# Altium project PCB_Project.PrjPcb
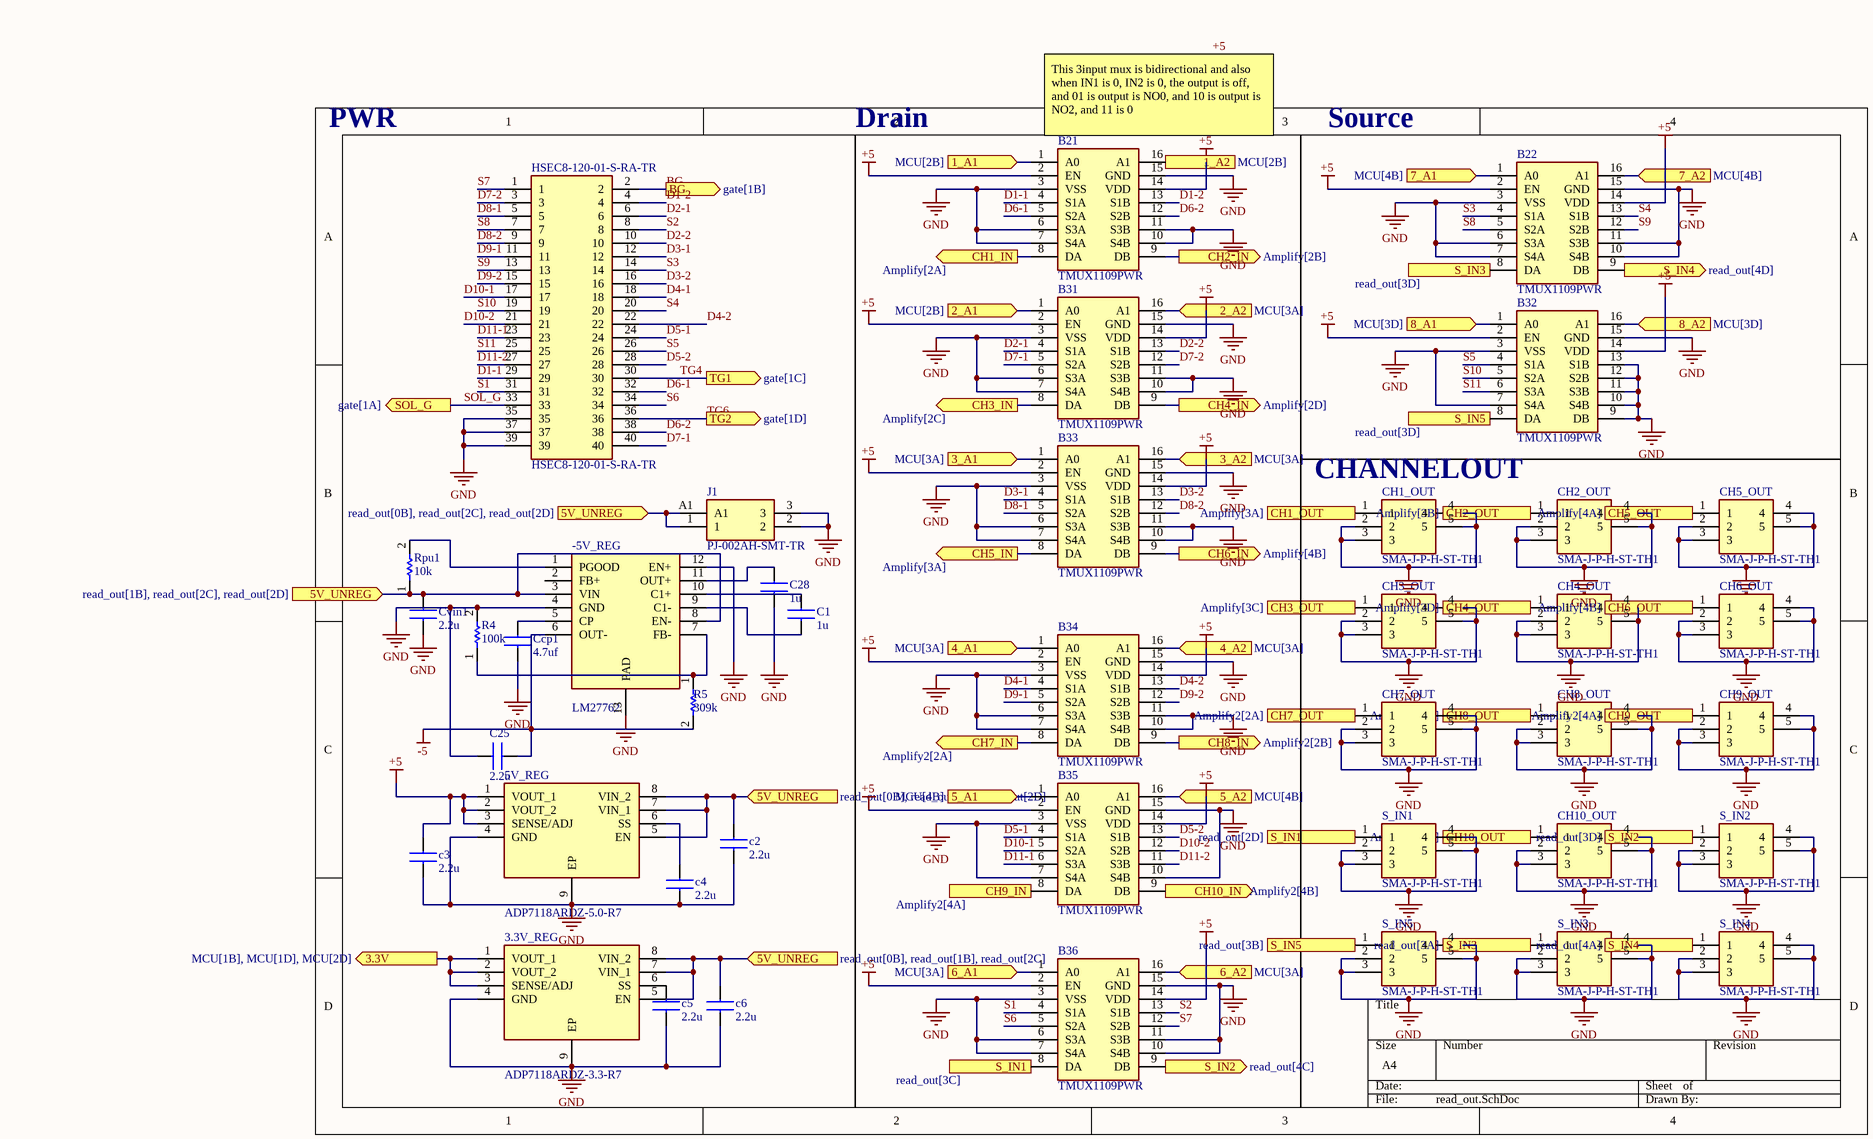
[diagram p0: read_out.SchDoc]
5 sheets, 163 parts. Net scope: flat (ports and power ports of the same name join across sheets).
Board file: PCB1.PcbDoc
Sheets:
  read_out.SchDoc
  Amplify.SchDoc
  Amplify2.SchDoc
  gate.SchDoc
  MCU.SchDoc

## Sheet read_out.SchDoc
size A4; SheetNumber: 1; SheetTotal: 5

### Parts
3.3V_REG  ADP7118ARDZ-3.3-R7  [ADP7118ARDZ-5.0-R7]
5V_REG  ADP7118ARDZ-5.0-R7  [ADP7118ARDZ-5.0-R7]
-5V_REG  LM27762  [LM27762]
B21  TMUX1109PWR  [TMUX1109PWR]
B22  TMUX1109PWR  [TMUX1109PWR]
B31  TMUX1109PWR  [TMUX1109PWR]
B32  TMUX1109PWR  [TMUX1109PWR]
B33  TMUX1109PWR  [TMUX1109PWR]
B34  TMUX1109PWR  [TMUX1109PWR]
B35  TMUX1109PWR  [TMUX1109PWR]
B36  TMUX1109PWR  [TMUX1109PWR]
C1  1u  [0805X7R106KT1AT]
c2  2.2u  [0805X7R106KT1AT]
c3  2.2u  [0805X7R106KT1AT]
c4  2.2u  [0805X7R106KT1AT]
c5  2.2u  [0805X7R106KT1AT]
c6  2.2u  [0805X7R106KT1AT]
C25  2.2u  [0805X7R106KT1AT]
C28  1u  [0805X7R106KT1AT]
Ccp1  4.7uf  [0805X7R106KT1AT]
CH1_OUT  SMA-J-P-H-ST-TH1  [SMAJPHSTTH1]
CH2_OUT  SMA-J-P-H-ST-TH1  [SMAJPHSTTH1]
CH3_OUT  SMA-J-P-H-ST-TH1  [SMAJPHSTTH1]
CH4_OUT  SMA-J-P-H-ST-TH1  [SMAJPHSTTH1]
CH5_OUT  SMA-J-P-H-ST-TH1  [SMAJPHSTTH1]
CH6_OUT  SMA-J-P-H-ST-TH1  [SMAJPHSTTH1]
CH7_OUT  SMA-J-P-H-ST-TH1  [SMAJPHSTTH1]
CH8_OUT  SMA-J-P-H-ST-TH1  [SMAJPHSTTH1]
CH9_OUT  SMA-J-P-H-ST-TH1  [SMAJPHSTTH1]
CH10_OUT  SMA-J-P-H-ST-TH1  [SMAJPHSTTH1]
Cvin1  2.2u  [0805X7R106KT1AT]
HSEC8-120-01-S-RA-TR  HSEC8-120-01-S-RA-TR  [SAMTEC_HSEC8-120-01-L-RA]
J1  PJ-002AH-SMT-TR  [PWRPJ]
R4  100k  [CR0805-FX-1543ELF]
R5  309k  [CR0805-FX-1543ELF]
Rpu1  10k  [CR0805-FX-1543ELF]
S_IN1  SMA-J-P-H-ST-TH1  [SMAJPHSTTH1]
S_IN2  SMA-J-P-H-ST-TH1  [SMAJPHSTTH1]
S_IN3  SMA-J-P-H-ST-TH1  [SMAJPHSTTH1]
S_IN4  SMA-J-P-H-ST-TH1  [SMAJPHSTTH1]
S_IN5  SMA-J-P-H-ST-TH1  [SMAJPHSTTH1]

### Ports
1_A1 (in, see MCU[2B]), 1_A2 (in, see MCU[2B]), 2_A1 (in, see MCU[2B]), 2_A2 (in, see MCU[3A]), 3.3V (out, see MCU[1B], MCU[1D], MCU[2D]), 3_A1 (in, see MCU[3A]), 3_A2 (in, see MCU[3A]), 4_A1 (in, see MCU[3A]), 4_A2 (in, see MCU[3A]), 5_A1 (in, see MCU[4B]), 5_A2 (in, see MCU[4B]), 5V_UNREG (in, see read_out[0B], read_out[1B], read_out[2C]), 5V_UNREG (in, see read_out[0B], read_out[1B], read_out[2D]), 5V_UNREG (in, see read_out[0B], read_out[2C], read_out[2D]), 5V_UNREG (in, see read_out[1B], read_out[2C], read_out[2D]), 6_A1 (in, see MCU[3A]), 6_A2 (in, see MCU[3A]), 7_A1 (in, see MCU[4B]), 7_A2 (in, see MCU[4B]), 8_A1 (in, see MCU[3D]), 8_A2 (in, see MCU[3D]), BG (out, see gate[1B]), CH1_IN (out, see Amplify[2A]), CH1_OUT (out, see Amplify[3A]), CH2_IN (out, see Amplify[2B]), CH2_OUT (out, see Amplify[3B]), CH3_IN (out, see Amplify[2C]), CH3_OUT (out, see Amplify[3C]), CH4_IN (out, see Amplify[2D]), CH4_OUT (out, see Amplify[3D]), CH5_IN (out, see Amplify[3A]), CH5_OUT (out, see Amplify[4A]), CH6_IN (out, see Amplify[4B]), CH6_OUT (out, see Amplify[4B]), CH7_IN (out, see Amplify2[2A]), CH7_OUT (out, see Amplify2[2A]), CH8_IN (out, see Amplify2[2B]), CH8_OUT (out, see Amplify2[3B]), CH9_IN (out, see Amplify2[4A]), CH9_OUT (out, see Amplify2[4A]), CH10_IN (out, see Amplify2[4B]), CH10_OUT (out, see Amplify2[5B]), S_IN1 (in, see read_out[2D]), S_IN1 (out, see read_out[3C]), S_IN2 (in, see read_out[3D]), S_IN2 (out, see read_out[4C]), S_IN3 (in, see read_out[3A]), S_IN3 (out, see read_out[3D]), S_IN4 (in, see read_out[4A]), S_IN4 (out, see read_out[4D]), S_IN5 (in, see read_out[3B]), S_IN5 (out, see read_out[3D]), SOL_G (out, see gate[1A]), TG1 (out, see gate[1C]), TG2 (out, see gate[1D])

### Nets
+5: 5V_REG.1(VOUT_1) 5V_REG.2(VOUT_2) 5V_REG.3(SENSE/ADJ) B21.2(EN) B21.14(VDD) B22.2(EN) B22.14(VDD) B31.2(EN) B31.14(VDD) B32.2(EN) B32.14(VDD) B33.2(EN) B33.14(VDD) B34.2(EN) B34.14(VDD) B35.2(EN) B35.14(VDD) B36.2(EN) B36.14(VDD) c3.2
-5: -5V_REG.6(OUT-) C25.1 R5.2
GND: 3.3V_REG.4(GND) 3.3V_REG.9(EP) 5V_REG.4(GND) 5V_REG.9(EP) -5V_REG.4(GND) -5V_REG.12(EN+) -5V_REG.13(PAD) B21.3(VSS) B21.6(S3A) B21.7(S4A) B21.10(S4B) B21.11(S3B) B21.15(GND) B22.3(VSS) B22.6(S3A) B22.7(S4A) B22.10(S4B) B22.11(S3B) B22.15(GND) B31.3(VSS) B31.6(S3A) B31.7(S4A) B31.10(S4B) B31.11(S3B) B31.15(GND) B32.3(VSS) B32.7(S4A) B32.9(DB) B32.10(S4B) B32.11(S3B) B32.12(S2B) B32.13(S1B) B32.15(GND) B33.3(VSS) B33.6(S3A) B33.7(S4A) B33.10(S4B) B33.11(S3B) B33.15(GND) B34.3(VSS) B34.6(S3A) B34.7(S4A) B34.10(S4B) B34.11(S3B) B34.15(GND) B35.3(VSS) B35.7(S4A) B35.10(S4B) B35.15(GND) B36.3(VSS) B36.6(S3A) B36.7(S4A) B36.10(S4B) B36.11(S3B) B36.15(GND) c2.1 c3.1 c4.1 c5.1 c6.1 C25.2 C28.1 Ccp1.1 CH1_OUT.2 CH1_OUT.3 CH1_OUT.4 CH1_OUT.5 CH2_OUT.2 CH2_OUT.3 CH2_OUT.4 CH2_OUT.5 CH3_OUT.2 CH3_OUT.3 CH3_OUT.4 CH3_OUT.5 CH4_OUT.2 CH4_OUT.3 CH4_OUT.4 CH4_OUT.5 CH5_OUT.2 CH5_OUT.3 CH5_OUT.4 CH5_OUT.5 CH6_OUT.2 CH6_OUT.3 CH6_OUT.4 CH6_OUT.5 CH7_OUT.2 CH7_OUT.3 CH7_OUT.4 CH7_OUT.5 CH8_OUT.2 CH8_OUT.3 CH8_OUT.4 CH8_OUT.5 CH9_OUT.2 CH9_OUT.3 CH9_OUT.4 CH9_OUT.5 CH10_OUT.2 CH10_OUT.3 CH10_OUT.4 CH10_OUT.5 Cvin1.1 HSEC8-120-01-S-RA-TR.35 HSEC8-120-01-S-RA-TR.37 HSEC8-120-01-S-RA-TR.39 J1.2 J1.3 R4.2 S_IN1.2 S_IN1.3 S_IN1.4 S_IN1.5 S_IN2.2 S_IN2.3 S_IN2.4 S_IN2.5 S_IN3.2 S_IN3.3 S_IN3.4 S_IN3.5 S_IN4.2 S_IN4.3 S_IN4.4 S_IN4.5 S_IN5.2 S_IN5.3 S_IN5.4 S_IN5.5
BG: HSEC8-120-01-S-RA-TR.2 ; port BG
D1-1: B21.4(S1A) HSEC8-120-01-S-RA-TR.29
D1-2: B21.13(S1B) HSEC8-120-01-S-RA-TR.4
D2-1: B31.4(S1A) HSEC8-120-01-S-RA-TR.6
D2-2: B31.13(S1B) HSEC8-120-01-S-RA-TR.10
D3-1: B33.4(S1A) HSEC8-120-01-S-RA-TR.12
D3-2: B33.13(S1B) HSEC8-120-01-S-RA-TR.16
D4-1: B34.4(S1A) HSEC8-120-01-S-RA-TR.18
D4-2: B34.13(S1B) HSEC8-120-01-S-RA-TR.22
D5-1: B35.4(S1A) HSEC8-120-01-S-RA-TR.24
D5-2: B35.13(S1B) HSEC8-120-01-S-RA-TR.28
D6-1: B21.5(S2A) HSEC8-120-01-S-RA-TR.32
D6-2: B21.12(S2B) HSEC8-120-01-S-RA-TR.38
D7-1: B31.5(S2A) HSEC8-120-01-S-RA-TR.40
D7-2: B31.12(S2B) HSEC8-120-01-S-RA-TR.3
D8-1: B33.5(S2A) HSEC8-120-01-S-RA-TR.5
D8-2: B33.12(S2B) HSEC8-120-01-S-RA-TR.9
D9-1: B34.5(S2A) HSEC8-120-01-S-RA-TR.11
D9-2: B34.12(S2B) HSEC8-120-01-S-RA-TR.15
D10-1: B35.5(S2A) HSEC8-120-01-S-RA-TR.17
D10-2: B35.12(S2B) HSEC8-120-01-S-RA-TR.21
D11-1: B35.6(S3A) HSEC8-120-01-S-RA-TR.23
D11-2: B35.11(S3B) HSEC8-120-01-S-RA-TR.27
S1: B36.4(S1A) HSEC8-120-01-S-RA-TR.31
S2: B36.13(S1B) HSEC8-120-01-S-RA-TR.8
S3: B22.4(S1A) HSEC8-120-01-S-RA-TR.14
S4: B22.13(S1B) HSEC8-120-01-S-RA-TR.20
S5: B32.4(S1A) HSEC8-120-01-S-RA-TR.26
S6: B36.5(S2A) HSEC8-120-01-S-RA-TR.34
S7: B36.12(S2B) HSEC8-120-01-S-RA-TR.1
S8: B22.5(S2A) HSEC8-120-01-S-RA-TR.7
S9: B22.12(S2B) HSEC8-120-01-S-RA-TR.13
S10: B32.5(S2A) HSEC8-120-01-S-RA-TR.19
S11: B32.6(S3A) HSEC8-120-01-S-RA-TR.25
SOL_G: HSEC8-120-01-S-RA-TR.33 ; port SOL_G
TG4: HSEC8-120-01-S-RA-TR.30 ; port TG1
TG6: HSEC8-120-01-S-RA-TR.36 ; port TG2
Net3.3V_REG_1: 3.3V_REG.1(VOUT_1) 3.3V_REG.2(VOUT_2) 3.3V_REG.3(SENSE/ADJ) ; port 3.3V
Net3.3V_REG_5: 3.3V_REG.5(EN) 3.3V_REG.7(VIN_1) 3.3V_REG.8(VIN_2) 5V_REG.5(EN) 5V_REG.7(VIN_1) 5V_REG.8(VIN_2) -5V_REG.3(VIN) -5V_REG.8(EN-) c2.2 c6.2 Cvin1.2 J1.1 J1.A1 Rpu1.1 ; port 5V_UNREG
Net3.3V_REG_6: 3.3V_REG.6(SS) c5.2
Net5V_REG_6: 5V_REG.6(SS) c4.2
Net-5V_REG_1: -5V_REG.1(PGOOD) Rpu1.2
Net-5V_REG_5: -5V_REG.5(CP) Ccp1.2
Net-5V_REG_7: -5V_REG.7(FB-) R4.1 R5.1
Net-5V_REG_9: -5V_REG.9(C1-) C1.1
Net-5V_REG_10: -5V_REG.10(C1+) C1.2
Net-5V_REG_11: -5V_REG.11(OUT+) C28.2
NetB2_6: B21.8(DA) ; port CH1_IN
NetB4_6: B21.9(DB) ; port CH2_IN
NetB6_6: B31.8(DA) ; port CH3_IN
NetB8_6: B31.9(DB) ; port CH4_IN
NetB10_6: B33.8(DA) ; port CH5_IN
NetB12_6: B33.9(DB) ; port CH6_IN
NetB15_6: B34.8(DA) ; port CH7_IN
NetB16_6: B35.8(DA) ; port CH9_IN
NetB19_6: B35.9(DB) ; port CH10_IN
NetB20_6: B34.9(DB) ; port CH8_IN
NetB21_1: B21.1(A0) ; port 1_A1
NetB21_16: B21.16(A1) ; port 1_A2
NetB22_1: B22.1(A0) ; port 7_A1
NetB22_8: B22.8(DA) S_IN3.1 ; port S_IN3
NetB22_9: B22.9(DB) S_IN4.1 ; port S_IN4
NetB22_16: B22.16(A1) ; port 7_A2
NetB31_1: B31.1(A0) ; port 2_A1
NetB31_16: B31.16(A1) ; port 2_A2
NetB32_1: B32.1(A0) ; port 8_A1
NetB32_8: B32.8(DA) S_IN5.1 ; port S_IN5
NetB32_16: B32.16(A1) ; port 8_A2
NetB33_1: B33.1(A0) ; port 3_A1
NetB33_16: B33.16(A1) ; port 3_A2
NetB34_1: B34.1(A0) ; port 4_A1
NetB34_16: B34.16(A1) ; port 4_A2
NetB35_1: B35.1(A0) ; port 5_A1
NetB35_16: B35.16(A1) ; port 5_A2
NetB36_1: B36.1(A0) ; port 6_A1
NetB36_8: B36.8(DA) S_IN1.1 ; port S_IN1
NetB36_9: B36.9(DB) S_IN2.1 ; port S_IN2
NetB36_16: B36.16(A1) ; port 6_A2
NetCH1_OUT_1: CH1_OUT.1 ; port CH1_OUT
NetCH2_OUT_1: CH2_OUT.1 ; port CH2_OUT
NetCH3_OUT_1: CH3_OUT.1 ; port CH3_OUT
NetCH4_OUT_1: CH4_OUT.1 ; port CH4_OUT
NetCH5_OUT_1: CH5_OUT.1 ; port CH5_OUT
NetCH6_OUT_1: CH6_OUT.1 ; port CH6_OUT
NetCH7_OUT_1: CH7_OUT.1 ; port CH7_OUT
NetCH8_OUT_1: CH8_OUT.1 ; port CH8_OUT
NetCH9_OUT_1: CH9_OUT.1 ; port CH9_OUT
NetCH10_OUT_1: CH10_OUT.1 ; port CH10_OUT

Not connected (* = marked no-connect by the designer): -5V_REG 2(FB+)

### Notes on the sheet
- PWR
- Drain
- (near B21) Type @ to refer to a designator or a net
- (near B21) This 3input mux is bidirectional and also when IN1 is 0, IN2 is 0, the output is off, and 01 is output is NO0, and 10 is output is NO2, and 11 is 0
- Source
- (near CH1_OUT) CHANNELOUT
- Labels drawn without touching a wire or pin: +5

### Library data of the parts
3.3V_REG = ADP7118ARDZ-5.0-R7
C1 c2-c6 C25 C28 Ccp1 = capacitor
CH1_OUT CH2_OUT CH3_OUT CH4_OUT CH5_OUT CH6_OUT CH7_OUT CH8_OUT CH9_OUT CH10_OUT S_IN1-S_IN5 = SMA-J-P-H-ST-TH1: SAMTEC - SMA-J-P-H-ST-TH1 - RF COAXIAL, SMA JACK, 50 OHM, PCB; Geometry.Height: 9.55mm; Mouser Part Number: 200-SMAJPHSTTH1; Mouser Price/Stock: https://www.mouser.co.uk/ProductDetail/Samtec/SMA-J-P-H-ST-TH1?qs=bkXRl3BLxbHdaAB2Qwy6zw%3D%3D; Manufacturer_Name: SAMTEC; Manufacturer_Part_Number: SMA-J-P-H-ST-TH1; Datasheet Link: http://suddendocs.samtec.com/prints/sma-j-p-x-st-th1-mkt.pdf
Cvin1 = 0805X7R106KT1AT
J1 = Powerinput
R4 R5 Rpu1 = resistor

## Sheet Amplify.SchDoc
size A4; SheetNumber: 2; SheetTotal: 5
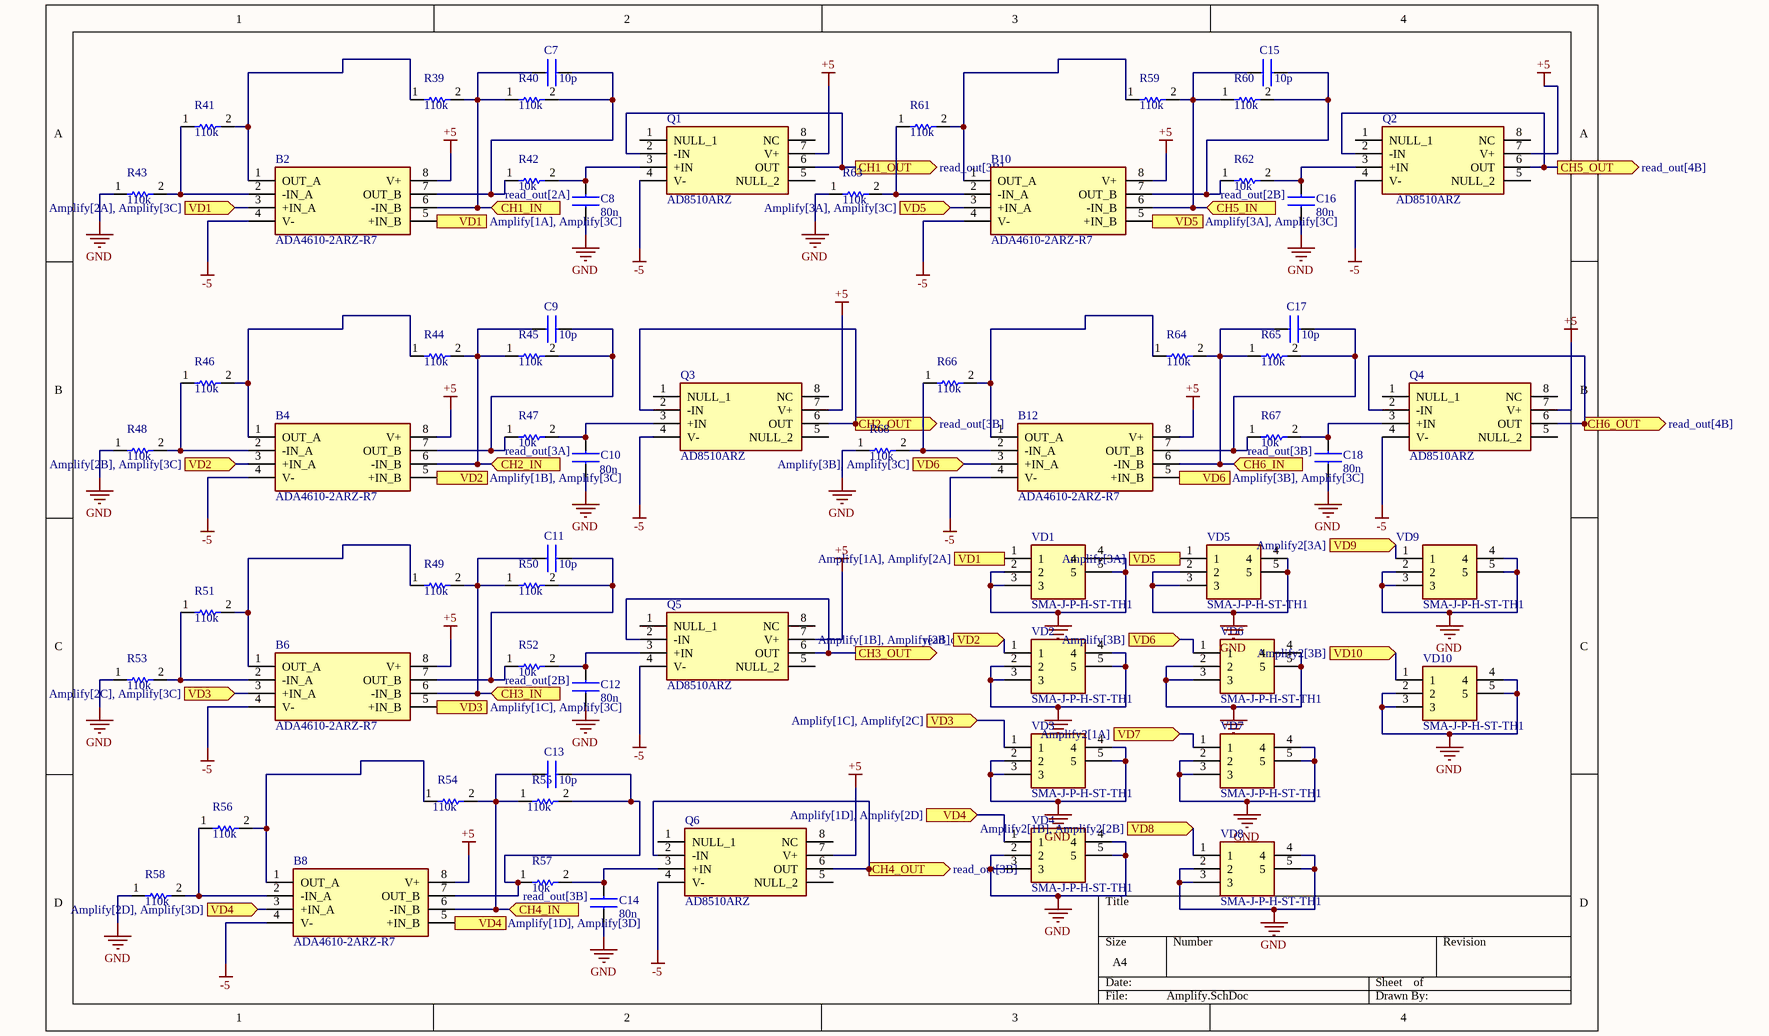
[diagram p1: Amplify.SchDoc]

### Parts
B2  ADA4610-2ARZ-R7  [SOIC127P600X175-8N]
B4  ADA4610-2ARZ-R7  [SOIC127P600X175-8N]
B6  ADA4610-2ARZ-R7  [SOIC127P600X175-8N]
B8  ADA4610-2ARZ-R7  [SOIC127P600X175-8N]
B10  ADA4610-2ARZ-R7  [SOIC127P600X175-8N]
B12  ADA4610-2ARZ-R7  [SOIC127P600X175-8N]
C7  10p  [0805X7R106KT1AT]
C8  80n  [0805X7R106KT1AT]
C9  10p  [0805X7R106KT1AT]
C10  80n  [0805X7R106KT1AT]
C11  10p  [0805X7R106KT1AT]
C12  80n  [0805X7R106KT1AT]
C13  10p  [0805X7R106KT1AT]
C14  80n  [0805X7R106KT1AT]
C15  10p  [0805X7R106KT1AT]
C16  80n  [0805X7R106KT1AT]
C17  10p  [0805X7R106KT1AT]
C18  80n  [0805X7R106KT1AT]
Q1  AD8510ARZ  [AD8510ARZ]
Q2  AD8510ARZ  [AD8510ARZ]
Q3  AD8510ARZ  [AD8510ARZ]
Q4  AD8510ARZ  [AD8510ARZ]
Q5  AD8510ARZ  [AD8510ARZ]
Q6  AD8510ARZ  [AD8510ARZ]
R39  110k  [CR0805-FX-1543ELF]
R40  110k  [CR0805-FX-1543ELF]
R41  110k  [CR0805-FX-1543ELF]
R42  10k  [CR0805-FX-1543ELF]
R43  110k  [CR0805-FX-1543ELF]
R44  110k  [CR0805-FX-1543ELF]
R45  110k  [CR0805-FX-1543ELF]
R46  110k  [CR0805-FX-1543ELF]
R47  10k  [CR0805-FX-1543ELF]
R48  110k  [CR0805-FX-1543ELF]
R49  110k  [CR0805-FX-1543ELF]
R50  110k  [CR0805-FX-1543ELF]
R51  110k  [CR0805-FX-1543ELF]
R52  10k  [CR0805-FX-1543ELF]
R53  110k  [CR0805-FX-1543ELF]
R54  110k  [CR0805-FX-1543ELF]
R55  110k  [CR0805-FX-1543ELF]
R56  110k  [CR0805-FX-1543ELF]
R57  10k  [CR0805-FX-1543ELF]
R58  110k  [CR0805-FX-1543ELF]
R59  110k  [CR0805-FX-1543ELF]
R60  110k  [CR0805-FX-1543ELF]
R61  110k  [CR0805-FX-1543ELF]
R62  10k  [CR0805-FX-1543ELF]
R63  110k  [CR0805-FX-1543ELF]
R64  110k  [CR0805-FX-1543ELF]
R65  110k  [CR0805-FX-1543ELF]
R66  110k  [CR0805-FX-1543ELF]
R67  10k  [CR0805-FX-1543ELF]
R68  110k  [CR0805-FX-1543ELF]
VD1  SMA-J-P-H-ST-TH1  [SMAJPHSTTH1]
VD2  SMA-J-P-H-ST-TH1  [SMAJPHSTTH1]
VD3  SMA-J-P-H-ST-TH1  [SMAJPHSTTH1]
VD4  SMA-J-P-H-ST-TH1  [SMAJPHSTTH1]
VD5  SMA-J-P-H-ST-TH1  [SMAJPHSTTH1]
VD6  SMA-J-P-H-ST-TH1  [SMAJPHSTTH1]
VD7  SMA-J-P-H-ST-TH1  [SMAJPHSTTH1]
VD8  SMA-J-P-H-ST-TH1  [SMAJPHSTTH1]
VD9  SMA-J-P-H-ST-TH1  [SMAJPHSTTH1]
VD10  SMA-J-P-H-ST-TH1  [SMAJPHSTTH1]

### Ports
CH1_IN (in, see read_out[2A]), CH1_OUT (out, see read_out[3B]), CH2_IN (in, see read_out[3A]), CH2_OUT (out, see read_out[3B]), CH3_IN (in, see read_out[2B]), CH3_OUT (out, see read_out[3B]), CH4_IN (in, see read_out[3B]), CH4_OUT (out, see read_out[3B]), CH5_IN (in, see read_out[2B]), CH5_OUT (out, see read_out[4B]), CH6_IN (in, see read_out[3B]), CH6_OUT (out, see read_out[4B]), VD1 (in, see Amplify[1A], Amplify[2A]), VD1 (in, see Amplify[1A], Amplify[3C]), VD1 (in, see Amplify[2A], Amplify[3C]), VD2 (in, see Amplify[1B], Amplify[2B]), VD2 (in, see Amplify[1B], Amplify[3C]), VD2 (in, see Amplify[2B], Amplify[3C]), VD3 (in, see Amplify[1C], Amplify[2C]), VD3 (in, see Amplify[1C], Amplify[3C]), VD3 (in, see Amplify[2C], Amplify[3C]), VD4 (in, see Amplify[1D], Amplify[2D]), VD4 (in, see Amplify[1D], Amplify[3D]), VD4 (in, see Amplify[2D], Amplify[3D]), VD5 (in, see Amplify[3A]), VD5 (in, see Amplify[3A], Amplify[3C]), VD6 (in, see Amplify[3B]), VD6 (in, see Amplify[3B], Amplify[3C]), VD7 (in, see Amplify2[1A]), VD8 (in, see Amplify2[1B], Amplify2[2B]), VD9 (in, see Amplify2[3A]), VD10 (in, see Amplify2[3B])

### Nets
+5: B2.8(V+) B4.8(V+) B6.8(V+) B8.8(V+) B10.8(V+) B12.8(V+) Q1.7(V+) Q2.7(V+) Q3.7(V+) Q4.7(V+) Q5.7(V+) Q6.7(V+)
-5: B2.4(V-) B4.4(V-) B6.4(V-) B8.4(V-) B10.4(V-) B12.4(V-) Q1.4(V-) Q2.4(V-) Q3.4(V-) Q4.4(V-) Q5.4(V-) Q6.4(V-)
GND: C8.2 C10.2 C12.2 C14.2 C16.2 C18.2 R43.1 R48.1 R53.1 R58.1 R63.1 R68.1 VD1.2 VD1.3 VD1.4 VD1.5 VD2.2 VD2.3 VD2.4 VD2.5 VD3.2 VD3.3 VD3.4 VD3.5 VD4.2 VD4.3 VD4.4 VD4.5 VD5.2 VD5.3 VD5.4 VD5.5 VD6.2 VD6.3 VD6.4 VD6.5 VD7.2 VD7.3 VD7.4 VD7.5 VD8.2 VD8.3 VD8.4 VD8.5 VD9.2 VD9.3 VD9.4 VD9.5 VD10.2 VD10.3 VD10.4 VD10.5
NetB2_1: B2.1(OUT_A) R39.1 R41.2
NetB2_2: B2.2(-IN_A) R41.1 R43.2
NetB2_3: B2.3(+IN_A) B2.5(+IN_B) VD1.1 ; port VD1
NetB2_6: B2.6(-IN_B) C7.1 R39.2 R40.1 ; port CH1_IN
NetB2_7: B2.7(OUT_B) C7.2 R40.2 R42.1
NetB4_1: B4.1(OUT_A) R44.1 R46.2
NetB4_2: B4.2(-IN_A) R46.1 R48.2
NetB4_3: B4.3(+IN_A) B4.5(+IN_B) VD2.1 ; port VD2
NetB4_6: B4.6(-IN_B) C9.1 R44.2 R45.1 ; port CH2_IN
NetB4_7: B4.7(OUT_B) C9.2 R45.2 R47.1
NetB6_1: B6.1(OUT_A) R49.1 R51.2
NetB6_2: B6.2(-IN_A) R51.1 R53.2
NetB6_3: B6.3(+IN_A) B6.5(+IN_B) VD3.1 ; port VD3
NetB6_6: B6.6(-IN_B) C11.1 R49.2 R50.1 ; port CH3_IN
NetB6_7: B6.7(OUT_B) C11.2 R50.2 R52.1
NetB8_1: B8.1(OUT_A) R54.1 R56.2
NetB8_2: B8.2(-IN_A) R56.1 R58.2
NetB8_3: B8.3(+IN_A) B8.5(+IN_B) VD4.1 ; port VD4
NetB8_6: B8.6(-IN_B) C13.1 R54.2 R55.1 ; port CH4_IN
NetB8_7: B8.7(OUT_B) C13.2 R55.2 R57.1
NetB10_1: B10.1(OUT_A) R59.1 R61.2
NetB10_2: B10.2(-IN_A) R61.1 R63.2
NetB10_3: B10.3(+IN_A) B10.5(+IN_B) VD5.1 ; port VD5
NetB10_6: B10.6(-IN_B) C15.1 R59.2 R60.1 ; port CH5_IN
NetB10_7: B10.7(OUT_B) C15.2 R60.2 R62.1
NetB12_1: B12.1(OUT_A) R64.1 R66.2
NetB12_2: B12.2(-IN_A) R66.1 R68.2
NetB12_3: B12.3(+IN_A) B12.5(+IN_B) VD6.1 ; port VD6
NetB12_6: B12.6(-IN_B) C17.1 R64.2 R65.1 ; port CH6_IN
NetB12_7: B12.7(OUT_B) C17.2 R65.2 R67.1
NetB15_3: VD7.1 ; port VD7
NetB16_3: VD9.1 ; port VD9
NetB19_3: VD10.1 ; port VD10
NetB20_3: VD8.1 ; port VD8
NetC8_1: C8.1 Q1.3(+IN) R42.2
NetC10_1: C10.1 Q3.3(+IN) R47.2
NetC12_1: C12.1 Q5.3(+IN) R52.2
NetC14_1: C14.1 Q6.3(+IN) R57.2
NetC16_1: C16.1 Q2.3(+IN) R62.2
NetC18_1: C18.1 Q4.3(+IN) R67.2
NetCH1_OUT_1: Q1.2(-IN) Q1.6(OUT) ; port CH1_OUT
NetCH2_OUT_1: Q3.2(-IN) Q3.6(OUT) ; port CH2_OUT
NetCH3_OUT_1: Q5.2(-IN) Q5.6(OUT) ; port CH3_OUT
NetCH4_OUT_1: Q6.2(-IN) Q6.6(OUT) ; port CH4_OUT
NetCH5_OUT_1: Q2.2(-IN) Q2.6(OUT) ; port CH5_OUT
NetCH6_OUT_1: Q4.2(-IN) Q4.6(OUT) ; port CH6_OUT

Not connected (* = marked no-connect by the designer): Q1 1(NULL_1) 5(NULL_2) 8(NC); Q2 1(NULL_1) 5(NULL_2) 8(NC); Q3 1(NULL_1) 5(NULL_2) 8(NC); Q4 1(NULL_1) 5(NULL_2) 8(NC); Q5 1(NULL_1) 5(NULL_2) 8(NC); Q6 1(NULL_1) 5(NULL_2) 8(NC)

### Library data of the parts
B2 B4 B6 B8 B10 B12 = ADA4610-2ARZ-R7: Low Noise, Precision, Rail-to-Rail Output, JFET Dual Op Amp +/-5 V to +/-15 V 40C to +125C; Manufacturer_Name: Analog Devices; Geometry.Height: 1.75mm; Mouser Part Number: 584-ADA4610-2ARZ-R7; Mouser Price/Stock: https://www.mouser.co.uk/ProductDetail/Analog-Devices/ADA4610-2ARZ-R7?qs=BpaRKvA4VqEBfMREioRxEg%3D%3D; Manufacturer_Part_Number: ADA4610-2ARZ-R7; Datasheet Link: https://www.analog.com/ADA4610-2/datasheet
C7-C18 = capacitor
R39-R68 = resistor
VD1-VD10 = SMA-J-P-H-ST-TH1: as CH1_OUT on sheet read_out; Mouser Part Number: 200-SMAJPHSTTH1; Mouser Price/Stock: https://www.mouser.co.uk/ProductDetail/Samtec/SMA-J-P-H-ST-TH1?qs=bkXRl3BLxbHdaAB2Qwy6zw%3D%3D; Manufacturer_Name: SAMTEC; Manufacturer_Part_Number: SMA-J-P-H-ST-TH1; Datasheet Link: http://suddendocs.samtec.com/prints/sma-j-p-x-st-th1-mkt.pdf

## Sheet Amplify2.SchDoc
size A4; SheetNumber: 3; SheetTotal: 5
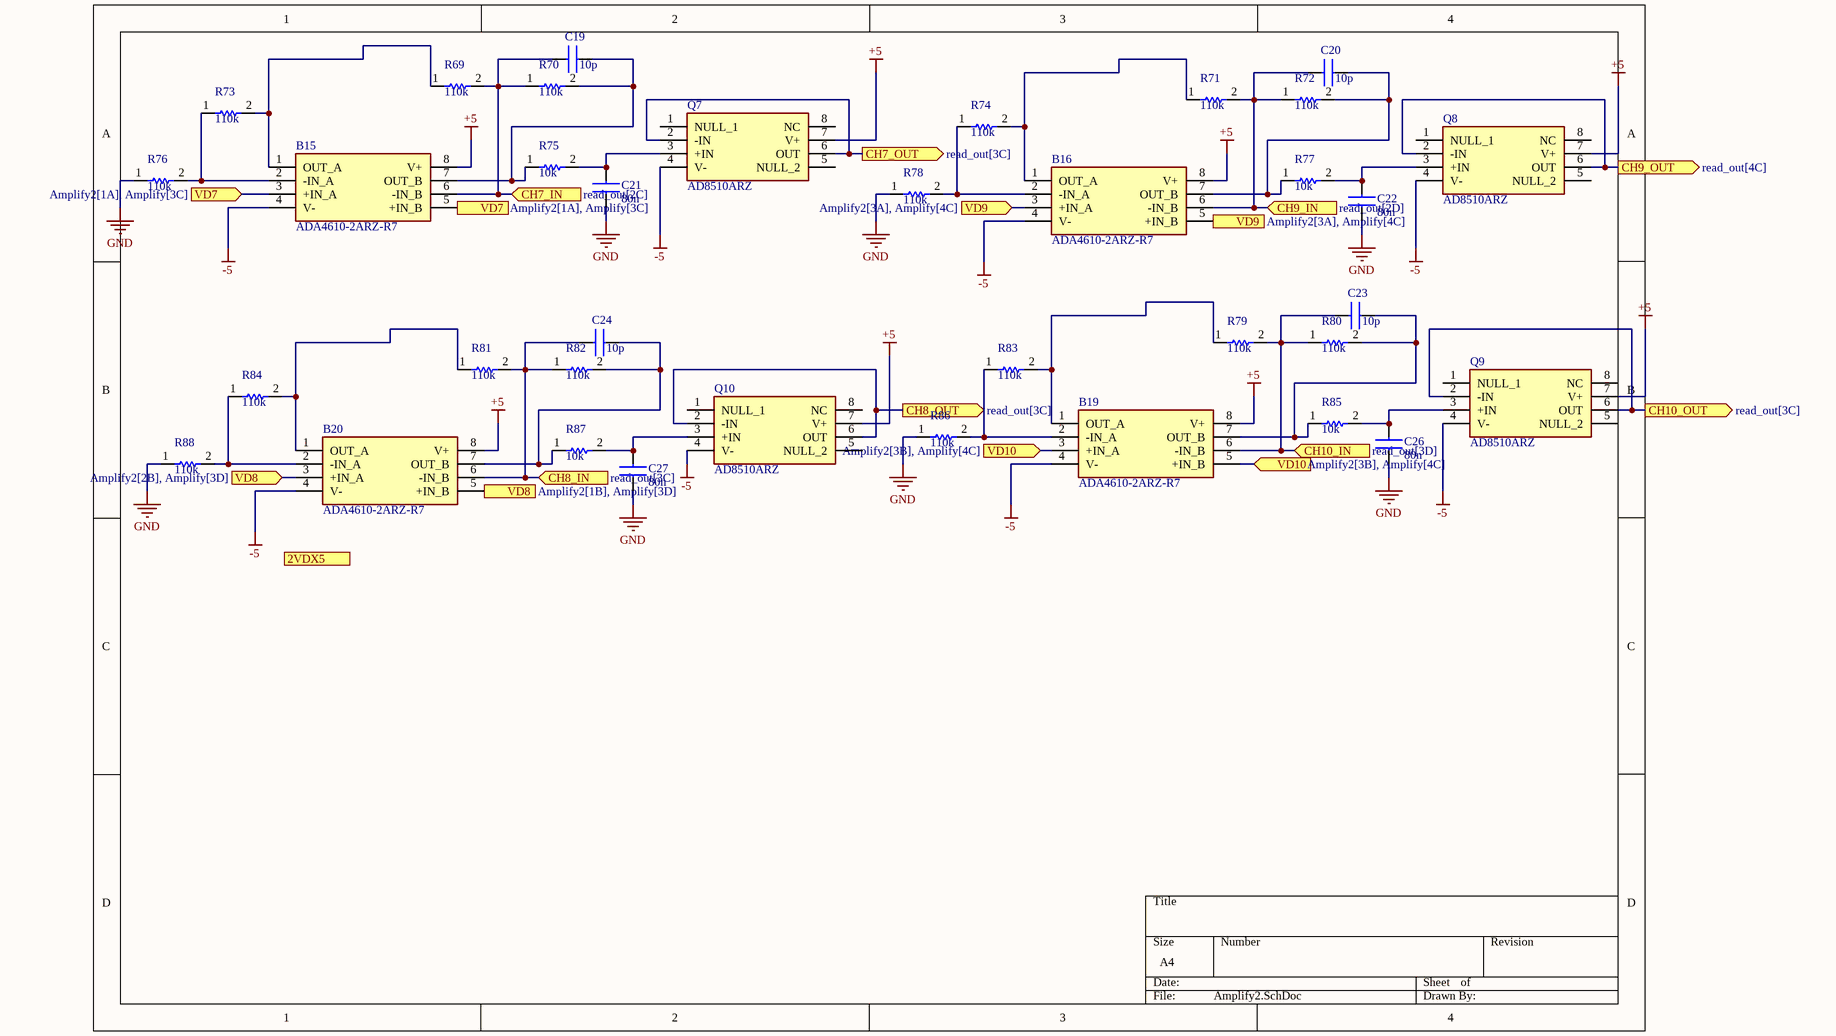
[diagram p2: Amplify2.SchDoc]

### Parts
B15  ADA4610-2ARZ-R7  [SOIC127P600X175-8N]
B16  ADA4610-2ARZ-R7  [SOIC127P600X175-8N]
B19  ADA4610-2ARZ-R7  [SOIC127P600X175-8N]
B20  ADA4610-2ARZ-R7  [SOIC127P600X175-8N]
C19  10p  [0805X7R106KT1AT]
C20  10p  [0805X7R106KT1AT]
C21  80n  [0805X7R106KT1AT]
C22  80n  [0805X7R106KT1AT]
C23  10p  [0805X7R106KT1AT]
C24  10p  [0805X7R106KT1AT]
C26  80n  [0805X7R106KT1AT]
C27  80n  [0805X7R106KT1AT]
Q7  AD8510ARZ  [AD8510ARZ]
Q8  AD8510ARZ  [AD8510ARZ]
Q9  AD8510ARZ  [AD8510ARZ]
Q10  AD8510ARZ  [AD8510ARZ]
R69  110k  [CR0805-FX-1543ELF]
R70  110k  [CR0805-FX-1543ELF]
R71  110k  [CR0805-FX-1543ELF]
R72  110k  [CR0805-FX-1543ELF]
R73  110k  [CR0805-FX-1543ELF]
R74  110k  [CR0805-FX-1543ELF]
R75  10k  [CR0805-FX-1543ELF]
R76  110k  [CR0805-FX-1543ELF]
R77  10k  [CR0805-FX-1543ELF]
R78  110k  [CR0805-FX-1543ELF]
R79  110k  [CR0805-FX-1543ELF]
R80  110k  [CR0805-FX-1543ELF]
R81  110k  [CR0805-FX-1543ELF]
R82  110k  [CR0805-FX-1543ELF]
R83  110k  [CR0805-FX-1543ELF]
R84  110k  [CR0805-FX-1543ELF]
R85  10k  [CR0805-FX-1543ELF]
R86  110k  [CR0805-FX-1543ELF]
R87  10k  [CR0805-FX-1543ELF]
R88  110k  [CR0805-FX-1543ELF]

### Ports
2VDX5 (in), CH7_IN (in, see read_out[2C]), CH7_OUT (out, see read_out[3C]), CH8_IN (in, see read_out[3C]), CH8_OUT (out, see read_out[3C]), CH9_IN (in, see read_out[2D]), CH9_OUT (out, see read_out[4C]), CH10_IN (in, see read_out[3D]), CH10_OUT (out, see read_out[3C]), VD7 (in, see Amplify2[1A], Amplify[3C]), VD8 (in, see Amplify2[1B], Amplify[3D]), VD8 (in, see Amplify2[2B], Amplify[3D]), VD9 (in, see Amplify2[3A], Amplify[4C]), VD10 (in, see Amplify2[3B], Amplify[4C])

### Nets
+5: B15.8(V+) B16.8(V+) B19.8(V+) B20.8(V+) Q7.7(V+) Q8.7(V+) Q9.7(V+) Q10.7(V+)
-5: B15.4(V-) B16.4(V-) B19.4(V-) B20.4(V-) Q7.4(V-) Q8.4(V-) Q9.4(V-) Q10.4(V-)
GND: C21.2 C22.2 C26.2 C27.2 R76.1 R78.1 R86.1 R88.1
NetB15_1: B15.1(OUT_A) R69.1 R73.2
NetB15_2: B15.2(-IN_A) R73.1 R76.2
NetB15_3: B15.3(+IN_A) B15.5(+IN_B) ; port VD7
NetB15_6: B15.6(-IN_B) C19.1 R69.2 R70.1 ; port CH7_IN
NetB15_7: B15.7(OUT_B) C19.2 R70.2 R75.1
NetB16_1: B16.1(OUT_A) R71.1 R74.2
NetB16_2: B16.2(-IN_A) R74.1 R78.2
NetB16_3: B16.3(+IN_A) B16.5(+IN_B) ; port VD9
NetB16_6: B16.6(-IN_B) C20.1 R71.2 R72.1 ; port CH9_IN
NetB16_7: B16.7(OUT_B) C20.2 R72.2 R77.1
NetB19_1: B19.1(OUT_A) R79.1 R83.2
NetB19_2: B19.2(-IN_A) R83.1 R86.2
NetB19_3: B19.3(+IN_A) B19.5(+IN_B) ; port VD10
NetB19_6: B19.6(-IN_B) C23.1 R79.2 R80.1 ; port CH10_IN
NetB19_7: B19.7(OUT_B) C23.2 R80.2 R85.1
NetB20_1: B20.1(OUT_A) R81.1 R84.2
NetB20_2: B20.2(-IN_A) R84.1 R88.2
NetB20_3: B20.3(+IN_A) B20.5(+IN_B) ; port VD8
NetB20_6: B20.6(-IN_B) C24.1 R81.2 R82.1 ; port CH8_IN
NetB20_7: B20.7(OUT_B) C24.2 R82.2 R87.1
NetC21_1: C21.1 Q7.3(+IN) R75.2
NetC22_1: C22.1 Q8.3(+IN) R77.2
NetC26_1: C26.1 Q9.3(+IN) R85.2
NetC27_1: C27.1 Q10.3(+IN) R87.2
NetCH7_OUT_1: Q7.2(-IN) Q7.6(OUT) ; port CH7_OUT
NetCH8_OUT_1: Q10.2(-IN) Q10.6(OUT) ; port CH8_OUT
NetCH9_OUT_1: Q8.2(-IN) Q8.6(OUT) ; port CH9_OUT
NetCH10_OUT_1: Q9.2(-IN) Q9.6(OUT) ; port CH10_OUT

Not connected (* = marked no-connect by the designer): Q7 1(NULL_1) 5(NULL_2) 8(NC); Q8 1(NULL_1) 5(NULL_2) 8(NC); Q9 1(NULL_1) 5(NULL_2) 8(NC); Q10 1(NULL_1) 5(NULL_2) 8(NC)

### Library data of the parts
B15 B16 B19 B20 = ADA4610-2ARZ-R7: as B2 on sheet Amplify; Mouser Part Number: 584-ADA4610-2ARZ-R7; Mouser Price/Stock: https://www.mouser.co.uk/ProductDetail/Analog-Devices/ADA4610-2ARZ-R7?qs=BpaRKvA4VqEBfMREioRxEg%3D%3D; Manufacturer_Part_Number: ADA4610-2ARZ-R7; Datasheet Link: https://www.analog.com/ADA4610-2/datasheet
C19-C24 C26 C27 = capacitor
R69-R88 = resistor

## Sheet gate.SchDoc
size A4; SheetNumber: 4; SheetTotal: 5
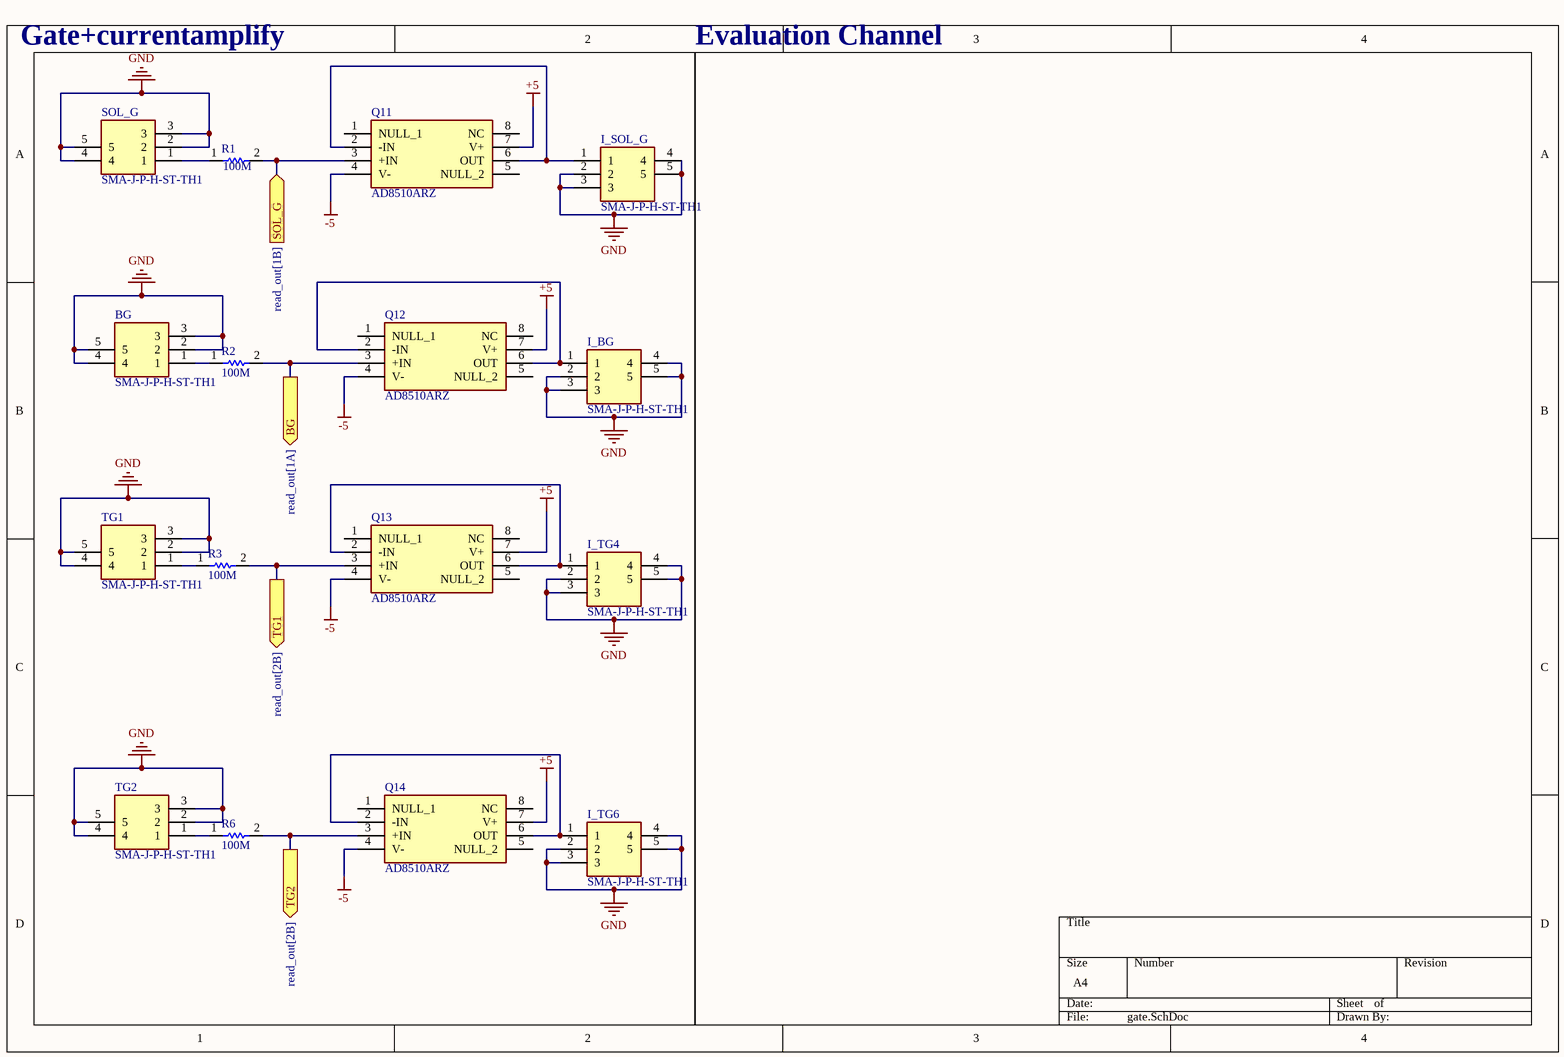
[diagram p3: gate.SchDoc]

### Parts
BG  SMA-J-P-H-ST-TH1  [SMAJPHSTTH1]
I_BG  SMA-J-P-H-ST-TH1  [SMAJPHSTTH1]
I_SOL_G  SMA-J-P-H-ST-TH1  [SMAJPHSTTH1]
I_TG4  SMA-J-P-H-ST-TH1  [SMAJPHSTTH1]
I_TG6  SMA-J-P-H-ST-TH1  [SMAJPHSTTH1]
Q11  AD8510ARZ  [AD8510ARZ]
Q12  AD8510ARZ  [AD8510ARZ]
Q13  AD8510ARZ  [AD8510ARZ]
Q14  AD8510ARZ  [AD8510ARZ]
R1  100M  [CR0805-FX-1543ELF]
R2  100M  [CR0805-FX-1543ELF]
R3  100M  [CR0805-FX-1543ELF]
R6  100M  [CR0805-FX-1543ELF]
SOL_G  SMA-J-P-H-ST-TH1  [SMAJPHSTTH1]
TG1  SMA-J-P-H-ST-TH1  [SMAJPHSTTH1]
TG2  SMA-J-P-H-ST-TH1  [SMAJPHSTTH1]

### Ports
BG (out, see read_out[1A]), SOL_G (in, see read_out[1B]), TG1 (out, see read_out[2B]), TG2 (out, see read_out[2B])

### Nets
+5: Q11.7(V+) Q12.7(V+) Q13.7(V+) Q14.7(V+)
-5: Q11.4(V-) Q12.4(V-) Q13.4(V-) Q14.4(V-)
GND: BG.2 BG.3 BG.4 BG.5 I_BG.2 I_BG.3 I_BG.4 I_BG.5 I_SOL_G.2 I_SOL_G.3 I_SOL_G.4 I_SOL_G.5 I_TG4.2 I_TG4.3 I_TG4.4 I_TG4.5 I_TG6.2 I_TG6.3 I_TG6.4 I_TG6.5 SOL_G.2 SOL_G.3 SOL_G.4 SOL_G.5 TG1.2 TG1.3 TG1.4 TG1.5 TG2.2 TG2.3 TG2.4 TG2.5
BG: Q12.3(+IN) R2.2 ; port BG
SOL_G: Q11.3(+IN) R1.2 ; port SOL_G
TG4: Q13.3(+IN) R3.2 ; port TG1
TG6: Q14.3(+IN) R6.2 ; port TG2
NetBG_1: BG.1 R2.1
NetI_BG_1: I_BG.1 Q12.2(-IN) Q12.6(OUT)
NetI_SOL_G_1: I_SOL_G.1 Q11.2(-IN) Q11.6(OUT)
NetI_TG4_1: I_TG4.1 Q13.2(-IN) Q13.6(OUT)
NetI_TG6_1: I_TG6.1 Q14.2(-IN) Q14.6(OUT)
NetR1_1: R1.1 SOL_G.1
NetR3_1: R3.1 TG1.1
NetR6_1: R6.1 TG2.1

Not connected (* = marked no-connect by the designer): Q11 1(NULL_1) 5(NULL_2) 8(NC); Q12 1(NULL_1) 5(NULL_2) 8(NC); Q13 1(NULL_1) 5(NULL_2) 8(NC); Q14 1(NULL_1) 5(NULL_2) 8(NC)

### Notes on the sheet
- Gate+currentamplify
- Evaluation Channel

### Library data of the parts
BG I_BG I_SOL_G I_TG4 I_TG6 SOL_G TG1 TG2 = SMA-J-P-H-ST-TH1: as CH1_OUT on sheet read_out; Mouser Part Number: 200-SMAJPHSTTH1; Mouser Price/Stock: https://www.mouser.co.uk/ProductDetail/Samtec/SMA-J-P-H-ST-TH1?qs=bkXRl3BLxbHdaAB2Qwy6zw%3D%3D; Manufacturer_Name: SAMTEC; Manufacturer_Part_Number: SMA-J-P-H-ST-TH1; Datasheet Link: http://suddendocs.samtec.com/prints/sma-j-p-x-st-th1-mkt.pdf
R1-R3 R6 = resistor

## Sheet MCU.SchDoc
size A4; SheetNumber: 5; SheetTotal: 5
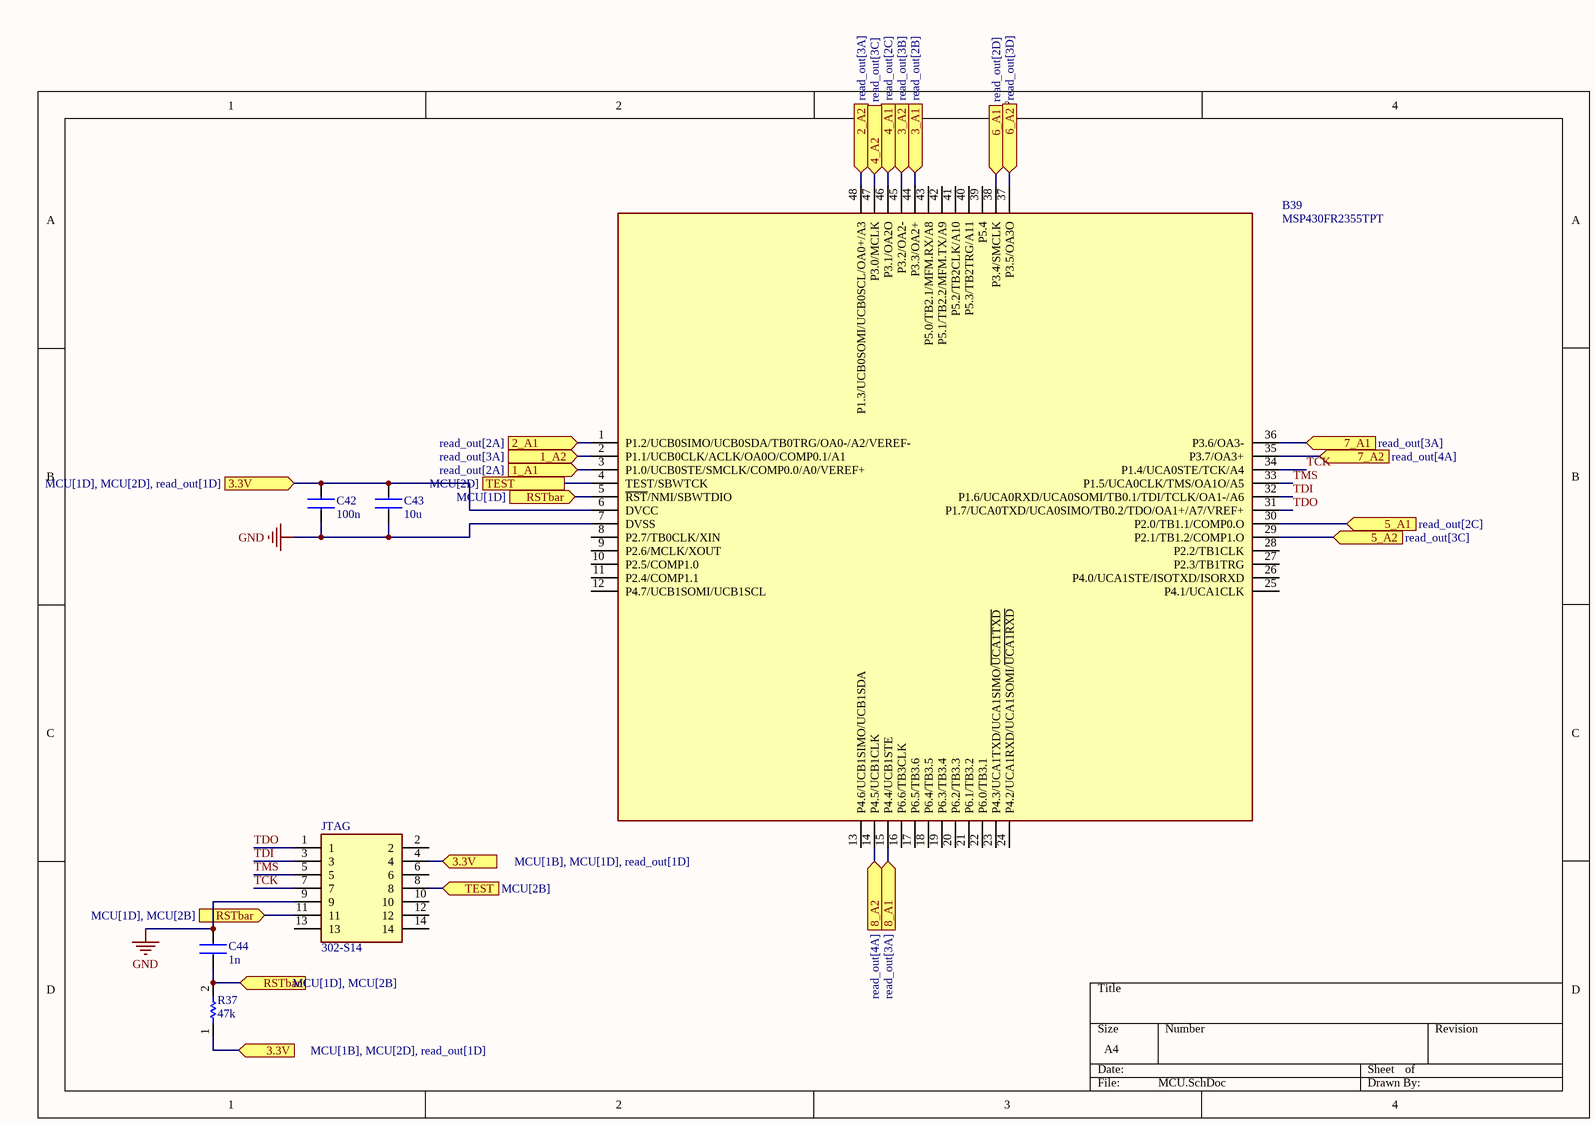
[diagram p4: MCU.SchDoc]

### Parts
B39  MSP430FR2355TPT  [QFP50P900X900X160-48N]
C42  100n  [0805X7R106KT1AT]
C43  10u  [0805X7R106KT1AT]
C44  1n  [0805X7R106KT1AT]
JTAG  302-S14  [CONN_7024614xx_MOL]
R37  47k  [CR0805-FX-1543ELF]

### Ports
1_A1 (in, see read_out[2A]), 1_A2 (in, see read_out[3A]), 2_A1 (in, see read_out[2A]), 2_A2 (in, see read_out[3A]), 3.3V (in, see MCU[1B], MCU[1D], read_out[1D]), 3.3V (in, see MCU[1B], MCU[2D], read_out[1D]), 3.3V (in, see MCU[1D], MCU[2D], read_out[1D]), 3_A1 (in, see read_out[2B]), 3_A2 (in, see read_out[3B]), 4_A1 (in, see read_out[2C]), 4_A2 (in, see read_out[3C]), 5_A1 (in, see read_out[2C]), 5_A2 (in, see read_out[3C]), 6_A1 (in, see read_out[2D]), 6_A2 (in, see read_out[3D]), 7_A1 (in, see read_out[3A]), 7_A2 (in, see read_out[4A]), 8_A1 (in, see read_out[3A]), 8_A2 (in, see read_out[4A]), RSTbar (in, see MCU[1D]), RSTbar (in, see MCU[1D], MCU[2B]), TEST (in, see MCU[2B]), TEST (see MCU[2D])

### Nets
GND: B39.7(DVSS) C42.2 C43.2 C44.2 JTAG.9
TCK: B39.34(P1.4/UCA0STE/TCK/A4) JTAG.7
TDI: B39.32(P1.6/UCA0RXD/UCA0SOMI/TB0.1/TDI/TCLK/OA1-/A6) JTAG.3
TDO: B39.31(P1.7/UCA0TXD/UCA0SIMO/TB0.2/TDO/OA1+/A7/VREF+) JTAG.1
TMS: B39.33(P1.5/UCA0CLK/TMS/OA1O/A5) JTAG.5
Net3.3V_REG_1: B39.6(DVCC) C42.1 C43.1 JTAG.4 R37.1 ; port 3.3V
NetB21_1: B39.3(P1.0/UCB0STE/SMCLK/COMP0.0/A0/VEREF+) ; port 1_A1
NetB21_16: B39.2(P1.1/UCB0CLK/ACLK/OA0O/COMP0.1/A1) ; port 1_A2
NetB22_1: B39.36(P3.6/OA3-) ; port 7_A1
NetB22_16: B39.35(P3.7/OA3+) ; port 7_A2
NetB31_1: B39.1(P1.2/UCB0SIMO/UCB0SDA/TB0TRG/OA0-/A2/VEREF-) ; port 2_A1
NetB31_16: B39.48(P1.3/UCB0SOMI/UCB0SCL/OA0+/A3) ; port 2_A2
NetB32_1: B39.15(P4.4/UCB1STE) ; port 8_A1
NetB32_16: B39.14(P4.5/UCB1CLK) ; port 8_A2
NetB33_1: B39.44(P3.3/OA2+) ; port 3_A1
NetB33_16: B39.45(P3.2/OA2-) ; port 3_A2
NetB34_1: B39.46(P3.1/OA2O) ; port 4_A1
NetB34_16: B39.47(P3.0/MCLK) ; port 4_A2
NetB35_1: B39.30(P2.0/TB1.1/COMP0.O) ; port 5_A1
NetB35_16: B39.29(P2.1/TB1.2/COMP1.O) ; port 5_A2
NetB36_1: B39.38(P3.4/SMCLK) ; port 6_A1
NetB36_16: B39.37(P3.5/OA3O) ; port 6_A2
NetB39_4: B39.4(TEST/SBWTCK) JTAG.8 ; port TEST
NetB39_5: B39.5(~{RST}/NMI/SBWTDIO) C44.1 JTAG.11 R37.2 ; port RSTbar

Not connected (* = marked no-connect by the designer): B39 8(P2.7/TB0CLK/XIN) 9(P2.6/MCLK/XOUT) 10(P2.5/COMP1.0) 11(P2.4/COMP1.1) 12(P4.7/UCB1SOMI/UCB1SCL) 13(P4.6/UCB1SIMO/UCB1SDA) 16(P6.6/TB3CLK) 17(P6.5/TB3.6) 18(P6.4/TB3.5) 19(P6.3/TB3.4) 20(P6.2/TB3.3) 21(P6.1/TB3.2) 22(P6.0/TB3.1) 23(P4.3/UCA1TXD/UCA1SIMO/~{UCA1TXD}) 24(P4.2/UCA1RXD/UCA1SOMI/~{UCA1RXD}) 25(P4.1/UCA1CLK) 26(P4.0/UCA1STE/ISOTXD/ISORXD) 27(P2.3/TB1TRG) 28(P2.2/TB1CLK) 39(P5.4) 40(P5.3/TB2TRG/A11) 41(P5.2/TB2CLK/A10) 42(P5.1/TB2.2/MFM.TX/A9) 43(P5.0/TB2.1/MFM.RX/A8); JTAG 2 6 10 12 13 14

### Library data of the parts
B39 = MSP430FR2355TPT: 16-bit Microcontrollers - MCU 24MHz 105C ULP Microcontroller With 32 KB FRAM, 4 KB SRAM, 44 IO, 12-bit ADC, 12-bit DACs, OpAmp/PGA 48-LQFP -40 to 105; Manufacturer_Name: Texas Instruments; Geometry.Height: 1.6mm; Mouser Part Number: 595-MSP430FR2355TPT; Mouser Price/Stock: https://www.mouser.co.uk/ProductDetail/Texas-Instruments/MSP430FR2355TPT?qs=gTYE2QTfZfTjQOKK%2F%2Fw59A%3D%3D; Manufacturer_Part_Number: MSP430FR2355TPT; Datasheet Link: https://datasheet.datasheetarchive.com/originals/distributors/DKDS41/DSANUWW0029426.pdf
C42-C44 = capacitor
JTAG = JTAG
R37 = resistor

## Nets that join several sheets
+5: read_out (20 pins), Amplify (12 pins), Amplify2 (8 pins), gate (Q11.7 Q12.7 Q13.7 Q14.7)
-5: read_out (-5V_REG.6 C25.1 R5.2), Amplify (12 pins), Amplify2 (8 pins), gate (Q11.4 Q12.4 Q13.4 Q14.4)
GND: read_out (130 pins), Amplify (52 pins), Amplify2 (8 pins), gate (32 pins), MCU (5 pins)
BG: read_out (HSEC8-120-01-S-RA-TR.2), gate (Q12.3 R2.2)
Net3.3V_REG_1: read_out (3.3V_REG.1 3.3V_REG.2 3.3V_REG.3), MCU (5 pins)
NetB2_6: read_out (B21.8), Amplify (B2.6 C7.1 R39.2 R40.1)
NetB4_6: read_out (B21.9), Amplify (B4.6 C9.1 R44.2 R45.1)
NetB6_6: read_out (B31.8), Amplify (B6.6 C11.1 R49.2 R50.1)
NetB8_6: read_out (B31.9), Amplify (B8.6 C13.1 R54.2 R55.1)
NetB10_6: read_out (B33.8), Amplify (B10.6 C15.1 R59.2 R60.1)
NetB12_6: read_out (B33.9), Amplify (B12.6 C17.1 R64.2 R65.1)
NetB15_3: Amplify (VD7.1), Amplify2 (B15.3 B15.5)
NetB15_6: read_out (B34.8), Amplify2 (B15.6 C19.1 R69.2 R70.1)
NetB16_3: Amplify (VD9.1), Amplify2 (B16.3 B16.5)
NetB16_6: read_out (B35.8), Amplify2 (B16.6 C20.1 R71.2 R72.1)
NetB19_3: Amplify (VD10.1), Amplify2 (B19.3 B19.5)
NetB19_6: read_out (B35.9), Amplify2 (B19.6 C23.1 R79.2 R80.1)
NetB20_3: Amplify (VD8.1), Amplify2 (B20.3 B20.5)
NetB20_6: read_out (B34.9), Amplify2 (B20.6 C24.1 R81.2 R82.1)
NetB21_1: read_out (B21.1), MCU (B39.3)
NetB21_16: read_out (B21.16), MCU (B39.2)
NetB22_1: read_out (B22.1), MCU (B39.36)
NetB22_16: read_out (B22.16), MCU (B39.35)
NetB31_1: read_out (B31.1), MCU (B39.1)
NetB31_16: read_out (B31.16), MCU (B39.48)
NetB32_1: read_out (B32.1), MCU (B39.15)
NetB32_16: read_out (B32.16), MCU (B39.14)
NetB33_1: read_out (B33.1), MCU (B39.44)
NetB33_16: read_out (B33.16), MCU (B39.45)
NetB34_1: read_out (B34.1), MCU (B39.46)
NetB34_16: read_out (B34.16), MCU (B39.47)
NetB35_1: read_out (B35.1), MCU (B39.30)
NetB35_16: read_out (B35.16), MCU (B39.29)
NetB36_1: read_out (B36.1), MCU (B39.38)
NetB36_16: read_out (B36.16), MCU (B39.37)
NetCH1_OUT_1: read_out (CH1_OUT.1), Amplify (Q1.2 Q1.6)
NetCH2_OUT_1: read_out (CH2_OUT.1), Amplify (Q3.2 Q3.6)
NetCH3_OUT_1: read_out (CH3_OUT.1), Amplify (Q5.2 Q5.6)
NetCH4_OUT_1: read_out (CH4_OUT.1), Amplify (Q6.2 Q6.6)
NetCH5_OUT_1: read_out (CH5_OUT.1), Amplify (Q2.2 Q2.6)
NetCH6_OUT_1: read_out (CH6_OUT.1), Amplify (Q4.2 Q4.6)
NetCH7_OUT_1: read_out (CH7_OUT.1), Amplify2 (Q7.2 Q7.6)
NetCH8_OUT_1: read_out (CH8_OUT.1), Amplify2 (Q10.2 Q10.6)
NetCH9_OUT_1: read_out (CH9_OUT.1), Amplify2 (Q8.2 Q8.6)
NetCH10_OUT_1: read_out (CH10_OUT.1), Amplify2 (Q9.2 Q9.6)
SOL_G: read_out (HSEC8-120-01-S-RA-TR.33), gate (Q11.3 R1.2)
TG4: read_out (HSEC8-120-01-S-RA-TR.30), gate (Q13.3 R3.2)
TG6: read_out (HSEC8-120-01-S-RA-TR.36), gate (Q14.3 R6.2)